# Altium schematic sheet Preamplifier_2.SchDoc
size A4
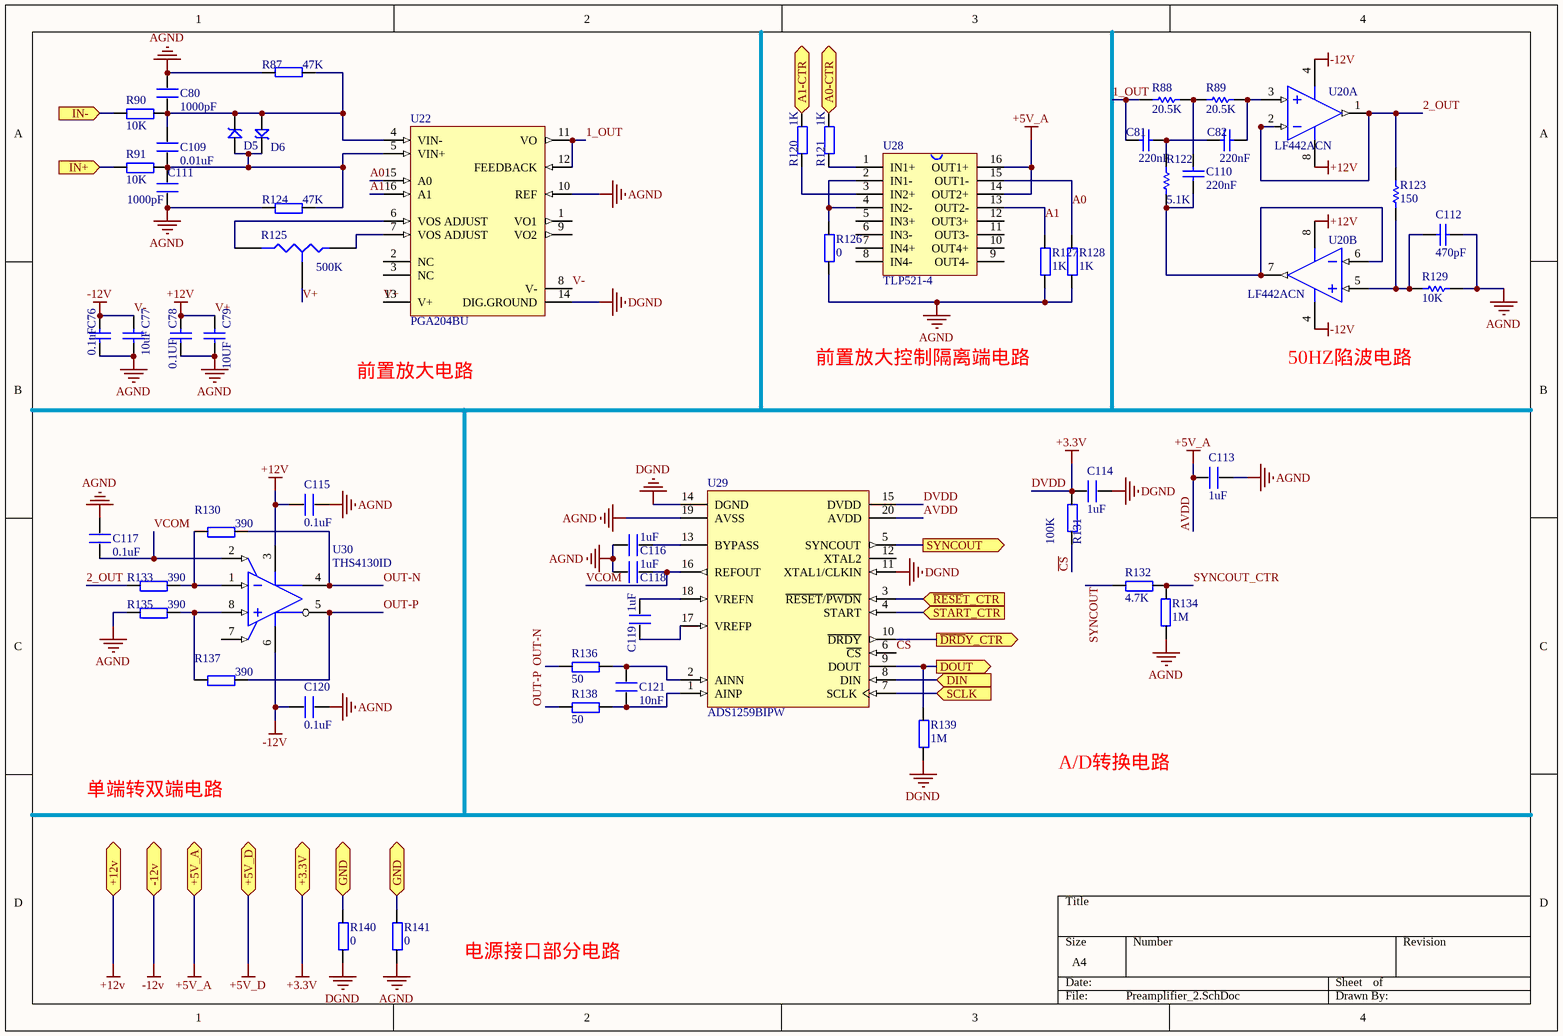
[diagram p0: Preamplifier_2.SchDoc]

## Parts
C76  0.1uF  [0805]
C77  10uF  [0805]
C78  0.1UF  [0805]
C79  10UF  [0805]
C80  1000pF  [0603P]
C81  220nF  [C0805]
C82  220nF  [C0805]
C109  0.01uF  [0603P]
C110  220nF  [C0805]
C111  1000pF  [0603P]
C112  470pF  [C0805]
C113  1uF  [0603P]
C114  1uF  [0603P]
C115  0.1uF  [0603P]
C116  1uF  [0603P]
C117  0.1uF  [0603P]
C118  1uF  [0603P]
C119  1uF  [0603P]
C120  0.1uF  [0603P]
C121  10nF  [0603P]
D5  SMBJ5.0A  [SMBJ]  (value not drawn)
D6  SMBJ5.0A  [SMBJ]  (value not drawn)
R87  47K  [0603P]
R88  20.5K  [R0805]
R89  20.5K  [R0805]
R90  10K  [0603P]
R91  10K  [0603P]
R120  1K  [0603P]
R121  1K  [0603P]
R122  5.1K  [R0805]
R123  150  [R0805]
R124  47K  [0603P]
R125  value 500K  [VR3]  (hidden comment: Res Tap)
R126  0  [0603P]
R127  1K  [0603P]
R128  1K  [0603P]
R129  10K  [R0805]
R130  390  [0603P]
R131  100K  [0603P]
R132  4.7K  [0603P]
R133  390  [0603P]
R134  1M  [0603P]
R135  390  [0603P]
R136  50  [0603P]
R137  390  [0603P]
R138  50  [0603P]
R139  1M  [0603P]
R140  0  [0603P]
R141  0  [0603P]
U20  LF442ACN  [N08E]  (parts A,B of 2)
U22  PGA204BU  [TI-DW16_N]
U28  TLP521-4  [11-20A3]
U29  ADS1259BIPW  [TI-PW20_N]
U30  THS4130ID  [TI-D8_N]

## Ports
+3.3V, +5V_A, +5V_D, +12v, -12v, A0-CTR (in), A1-CTR (in), DIN (in), DOUT (out), GND, IN+ (in), IN- (in), SCLK (in), START_CTR (in), SYNCOUT (out), ~{DRD}Y_CTR (out), ~{RESE}T_CTR (in)

## Nets
+5V_D: port +5V_D
AGND: C76.1 C77.1 C78.1 C79.1 C80.2 C111.1 C112.1 C113.1 C115.1 C116.1 C117.1 C118.1 C120.1 R87.2 R124.1 R126.1 R127.1 R128.1 R129.1 R134.2 R135.1 R141.1 U22.10(REF) U29.19(AVSS)
AVDD: C113.2 U28.14(OUT2+) U28.16(OUT1+) U29.20(AVDD) ; port +5V_A  [also labelled +5V_A]
DGND: C114.1 R139.1 R140.1 U22.14(DIG.GROUND) U29.11(XTAL1/CLKIN) U29.14(DGND)
DVDD: C114.2 R131.2 U29.15(DVDD) ; port +3.3V  [also labelled +3.3V]
V+: C78.2 C79.2 C115.2 R125.3(TAP) U20.8(V+) U22.13(V+) U30.3(VCC+) ; port +12v  [also labelled +12V]
V-: C76.2 C77.2 C120.2 U20.4(V-) U22.8(V-) U30.6(VCC-) ; port -12v  [also labelled -12V]
1_OUT: C81.1 R88.1 U22.11(VO) U22.12(FEEDBACK)
2_OUT: R123.2 R133.1 U20.1(OUTA) U20.2(INA-)
A0: R128.2 U22.15(A0) U28.15(OUT1-)
A0-CTR: R121.2 ; port A0-CTR
A1: R127.2 U22.16(A1) U28.13(OUT2-)
A1-CTR: R120.2 ; port A1-CTR
~{CS}: R131.1 U29.6(~{CS})
~{DRD}Y_CTR: U29.10(~{DRDY}) ; port ~{DRD}Y_CTR
DIN: U29.8(DIN) ; port DIN
DOUT: R139.2 U29.9(DOUT) ; port DOUT
GND: R140.2 R141.2 ; port GND
IN+: R91.1 ; port IN+
IN-: R90.1 ; port IN-
OUT-N: R130.2 R136.1 U30.4(VOUT+)
OUT-P: R137.2 R138.1 U30.5(VOUT-)
~{RESE}T_CTR: U29.3(~{RESET}/~{PWDN}) ; port ~{RESE}T_CTR
SCLK: U29.7(SCLK) ; port SCLK
START_CTR: U29.4(START) ; port START_CTR
SYNCOUT: U29.5(SYNCOUT) ; port SYNCOUT
SYNCOUT: R132.1  [a separate net that carries the same name]
SYNCOUT_CTR: R132.2 R134.1
VCOM: C117.2 C118.2 U29.16(REFOUT) U30.2(VOCM)
NetC80_1: C80.1 C109.2 D5.2 D6.1 R87.1 R90.2 U22.4(VIN-)
NetC81_2: C81.2 C82.1 R122.2
NetC82_2: C82.2 R89.2 U20.3(INA+)
NetC109_1: C109.1 C111.2 D5.1 D6.2 R91.2 R124.2 U22.5(VIN+)
NetC110_1: C110.1 R122.1 U20.6(INB-) U20.7(OUTB)
NetC110_2: C110.2 R88.2 R89.1
NetC112_2: C112.2 R123.1 R129.2 U20.5(INB+)
NetC116_2: C116.2 U29.13(BYPASS)
NetC119_1: C119.1 U29.18(VREFN)
NetC119_2: C119.2 U29.17(VREFP)
NetC121_1: C121.1 R138.2 U29.1(AINP)
NetC121_2: C121.2 R136.2 U29.2(AINN)
NetR120_1: R120.1 U28.3(IN2+)
NetR121_1: R121.1 U28.1(IN1+)
NetR125_1: R125.1(A) U22.7(VOS_ADJUST)
NetR125_2: R125.2(B) U22.6(VOS_ADJUST)
NetR126_2: R126.2 U28.2(IN1-) U28.4(IN2-)
NetR130_1: R130.1 R133.2 U30.1(VIN-)
NetR135_2: R135.2 R137.1 U30.8(VIN+)

Not connected (* = marked no-connect by the designer): U22 1(VO1) 2(NC) 3(NC) 9(VO2); U28 5(IN3+) 6(IN3-) 7(IN4+) 8(IN4-) 9(OUT4-) 10(OUT4+) 11(OUT3-) 12(OUT3+); U29 12(XTAL2); U30 7(~{PD})

## Notes on the sheet
- 前置放大电路
- 前置放大控制隔离端电路
- (near U20) 50HZ陷波电路
- A/D转换电路
- 单端转双端电路
- 电源接口部分电路

## Library data of the parts
C76-C79 C81 C82 C110 C112 = Cap: Capacitor; Published: 8-Jun-2000; LatestRevisionDate: 17-Jul-2002; LatestRevisionNote: Re-released for DXP Platform.; PackageReference: RAD-0.3; Publisher: Altium Limited; PackageDescription: Radial Cap, Thru-Hole; 2 Leads; 0.3 in Pin Spacing
  C76 C78: Value: 0.1UF
  C77 C79: Value: 10UF
  C81 C82 C110: Value: 220nF
  C112: Value: 470pF
C80 C109 C111 C113-C121 = C
D5 D6 = SMBJ: TVS
R87 R90 R91 R120 R121 R124 R126-R128 R130-R141 = R
R88 R89 R122 R123 R129 = Res1: Resistor; Published: 8-Jun-2000; LatestRevisionDate: 17-Jul-2002; LatestRevisionNote: Re-released for DXP Platform.; PackageReference: AXIAL-0.3; Publisher: Altium Limited; PackageDescription: Axial Device, Thru-Hole; 2 Leads; 0.3 in Pin Spacing
  R88 R89: Value: 20.5K
  R122: Value: 5.1K
  R123: Value: 150
  R129: Value: 10K
R125 = Res Tap: Tapped Resistor; Sim Note: Enter the Resistance value and the set point into parameter fields.; Set Position: 0.5; Published: 24-Mar-1999; LatestRevisionDate: 17-Jul-2002; LatestRevisionNote: Re-released for DXP Platform.; PackageReference: VR3; Publisher: Altium Limited; PackageDescription: Variable Resistor, Thru-Hole; 3 Leads
U20 = LF442ACN: Dual Low Power JFET Input Operational Amplifier, 8-pin MDIP; Manufacturer: National Semiconductor; PackageTopMarking: NSUZXYTTE#*LF*442ACN; PowerWise: N; CompType: Amplifiers; Published: 4-Dec-2008; LatestRevisionDate: 13-Jan-2009; LatestRevisionNote: Sim Model Added.; DatasheetVersion: Aug-2000; PackageVersion: revG, May-2006; PackageReference: N08E; Publisher: Altium Limited; PackageDescription: MDIP, .365 x .250 x .130in, 8 Lead, .100in Pitch; Supplier 1: Farnell; Supplier Part Number 1: 4465726; PartNumber: LF442ACN; RoHS: N; PinCount: 8; Code_JEDEC: MS-001-BA; ComponentLink1Description: LF442 Datasheet; ComponentLink1URL: http://www.national.com/ds/LF/LF442.pdf; ComponentLink2Description: LF442 Web Page; ComponentLink2URL: http://www.national.com/pf/LF/LF442.html; ComponentLink3Description: N08E Package Page; ComponentLink3URL: http://www.national.com/packaging/folders/n08e.html
U22 = PGA204BU: Programmable Gain Instrumentation Amplifier, -40 to 85 degC, 16-pin SOIC (DW16), Green (RoHS & no Sb/Br); Manufacturer: Texas Instruments; Common Mode Input High(Min)(V): 10.5; Common Mode Input Low(Min)(V): -10.5; Gain Error (+/-)(Max)(%): 0.024; Gain(V/V): 1, 10, 100, 1000; Input Bias Current (+/-)(Max)(nA): 2; Input Offset (+/-)(Max)(uV): 50; Input Offset Drift (+/-)(Max)(uV/Degrees Celsius): 0.25; Noise at 1kHz(Typ)(nV/rt(Hz)): 13; Non-Linearity (+/-)(Max)(%): 0.001; Number of Channels: 1; Quiescent Current (+/-)(Typ)(mA): 5.2; Settling Time to 0.01%(Typ)(us): 140; Slew Rate(Typ)(V/us): 0.7; SubFamily: Programmable Gain Amplifier; Vs(Max)(V): 36; Vs(Min)(V): 9; DatasheetVersion: SBOS022; PackageVersion: 4040000-2/G, 01/2011; PackageReference: DW16; PackageDescription: 16-Pin Plastic Small Outline, Body 10.30 x 7.50 mm, Pitch 1.27 mm; Supplier 1: Digi-Key; Supplier Part Number 1: PGA204BU-ND; Supplier 2: Farnell; Supplier Part Number 2: 1207094; Supplier 3: Newark; Supplier Part Number 3: 24M5804; Supplier 4: Newark; Supplier Part Number 4: 35C1958; Supplier 5: Mouser; Supplier Part Number 5: 595-PGA204BU; Eco-Plan: Green (RoHS & no Sb/Br); Mounting Technology: Surface Mount; Code_JEDEC: MS-013; PartNumber: PGA204BU; ComponentLink1Description: Manufacturer URL; ComponentLink1URL: http://www.ti.com/; ComponentLink2Description: Datasheet; ComponentLink2URL: http://www.ti.com/general/docs/lit/getliterature.tsp?genericPartNumber=PGA204&fileType=pdf; ComponentLink3Description: Package Specification; ComponentLink3URL: http://www.ti.com/litv/pdf/msoi003g
U28 = TLP521
U29 = ADS1259BIPW: Low-Noise, 14 kSPS, 24-Bit ADC, -40 to 105 degC, 20-pin SOP (PW20), Green (RoHS & no Sb/Br); Manufacturer: Texas Instruments; # Input Channels: 1; Analog Voltage AV/DD(Max)(V): 5.25; Analog Voltage AV/DD(Min)(V): 4.75; Architecture: Delta-Sigma; Digital Supply(Min)(V): 2.7; Interface: Serial SPI; Resolution(Bits): 24; Sample Rate (max)(SPS): 14.4K; SubFamily: Precision ADC (<=10MSPS); DatasheetVersion: SBAS424D; PackageVersion: 4040064-5/G, 02/2011; PackageReference: PW20; PackageDescription: 20-Pin Plastic Small Outline, Body 6.5 x 4.4 mm, Pitch 0.65 mm; Supplier 1: Digi-Key; Supplier Part Number 1: TLC3548IPWRG4-ND; Supplier 2: Mouser; Supplier Part Number 2: 595-TLC3548IPWRG4; Digital Supply(Max)(V): 5.25; Eco-Plan: Green (RoHS & no Sb/Br); Mounting Technology: Surface Mount; Code_JEDEC: MO-153; PartNumber: ADS1259BIPW; ComponentLink1Description: Manufacturer URL; ComponentLink1URL: http://www.ti.com/; ComponentLink2Description: Datasheet; ComponentLink2URL: http://www.ti.com/general/docs/lit/getliterature.tsp?genericPartNumber=ADS1259&fileType=pdf; ComponentLink3Description: Package Specification; ComponentLink3URL: http://www.ti.com.cn/cn/lit/ml/mpds362/mpds362.pdf
U30 = THS4130ID: Fully Differential Input / Output Low Noise Amplifier with Shutdown, 5 to 30 V, -40 to 85 degC, 8-pin SOIC (D8), Green (RoHS & no Sb/Br); Manufacturer: Texas Instruments; 2nd Harmonic(dBc): 88; 3rd Harmonic(dBc): 82; @ MHz: 1; BW @ Acl(MHz): 150; Io(Typ)(mA): 85; Iq per channel(Max)(mA): 16; Offset Voltage Drift (+/-)(Max)(uV/Degrees Celsius: 4.5; Settling Time (0.1%)(Typ)(ns): 78; Slew Rate(Typ)(V/us): 52; SubFamily: Fully Differential Amplifier; THD (Fc is 1 MHz)(Typ)(dB): -80; Vio(Max)(mV): 2; Vn at Flatband(Typ)(nV/rtHz): 1.3; Vs(Max)(V): 30; Vs(Min)(V): 5; DatasheetVersion: SLOS318H; PackageVersion: 4040047-3/M, 06/2011; PackageReference: D8; PackageDescription: 8-Pin Plastic Small Outline, Body 4.9 x 3.9 mm, Pitch 1.27 mm; Supplier 1: Digi-Key; Supplier Part Number 1: 296-7554-5-ND; Supplier 2: Farnell; Supplier Part Number 2: 1103108; Supplier 3: Newark; Supplier Part Number 3: 24M8257; Supplier 4: Newark; Supplier Part Number 4: 76C6405; Supplier 5: Mouser; Supplier Part Number 5: 595-THS4130ID; Eco-Plan: Green (RoHS & no Sb/Br); Number of Channels: 1; Mounting Technology: Surface Mount; Code_JEDEC: MS-012; PartNumber: THS4130ID; ComponentLink1Description: Manufacturer URL; ComponentLink1URL: http://www.ti.com/; ComponentLink2Description: Datasheet; ComponentLink2URL: http://www.ti.com/general/docs/lit/getliterature.tsp?genericPartNumber=THS4130&fileType=pdf; ComponentLink3Description: Package Specification; ComponentLink3URL: http://www.ti.com/litv/pdf/msoi002j